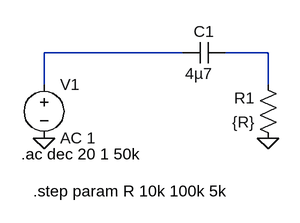
[diagram p0: schematic Lowpass.asc]
Lowpass.asc, the LTspice schematic file:
Version 4
SHEET 1 880 680
WIRE 48 128 -160 128
WIRE 176 128 112 128
WIRE -160 176 -160 128
WIRE 176 176 176 128
FLAG -160 256 0
FLAG 176 256 0
SYMBOL res 192 272 R180
WINDOW 0 36 76 Left 2
WINDOW 3 36 40 Left 2
SYMATTR InstName R1
SYMATTR Value {R}
SYMBOL cap 112 112 R90
WINDOW 0 0 32 VBottom 2
WINDOW 3 32 40 VTop 2
SYMATTR InstName C1
SYMATTR Value 4µ7
SYMBOL voltage -160 160 R0
WINDOW 123 0 0 Left 2
WINDOW 39 0 0 Left 2
SYMATTR InstName V1
SYMATTR Value AC 1
TEXT -194 280 Left 2 !.ac dec 20 1 50k
TEXT -176 336 Left 2 !.step param R 10k 100k 5k

The netlist it stands for:
* Lowpass.asc
R1 0 N002 {R}
C1 N002 N001 4µ7
V1 N001 0 AC 1
.ac dec 20 1 50k
.step param R 10k 100k 5k
.backanno
.end